# EAGLE design qtpy_midibff_disp (EAGLE 9.6.2)
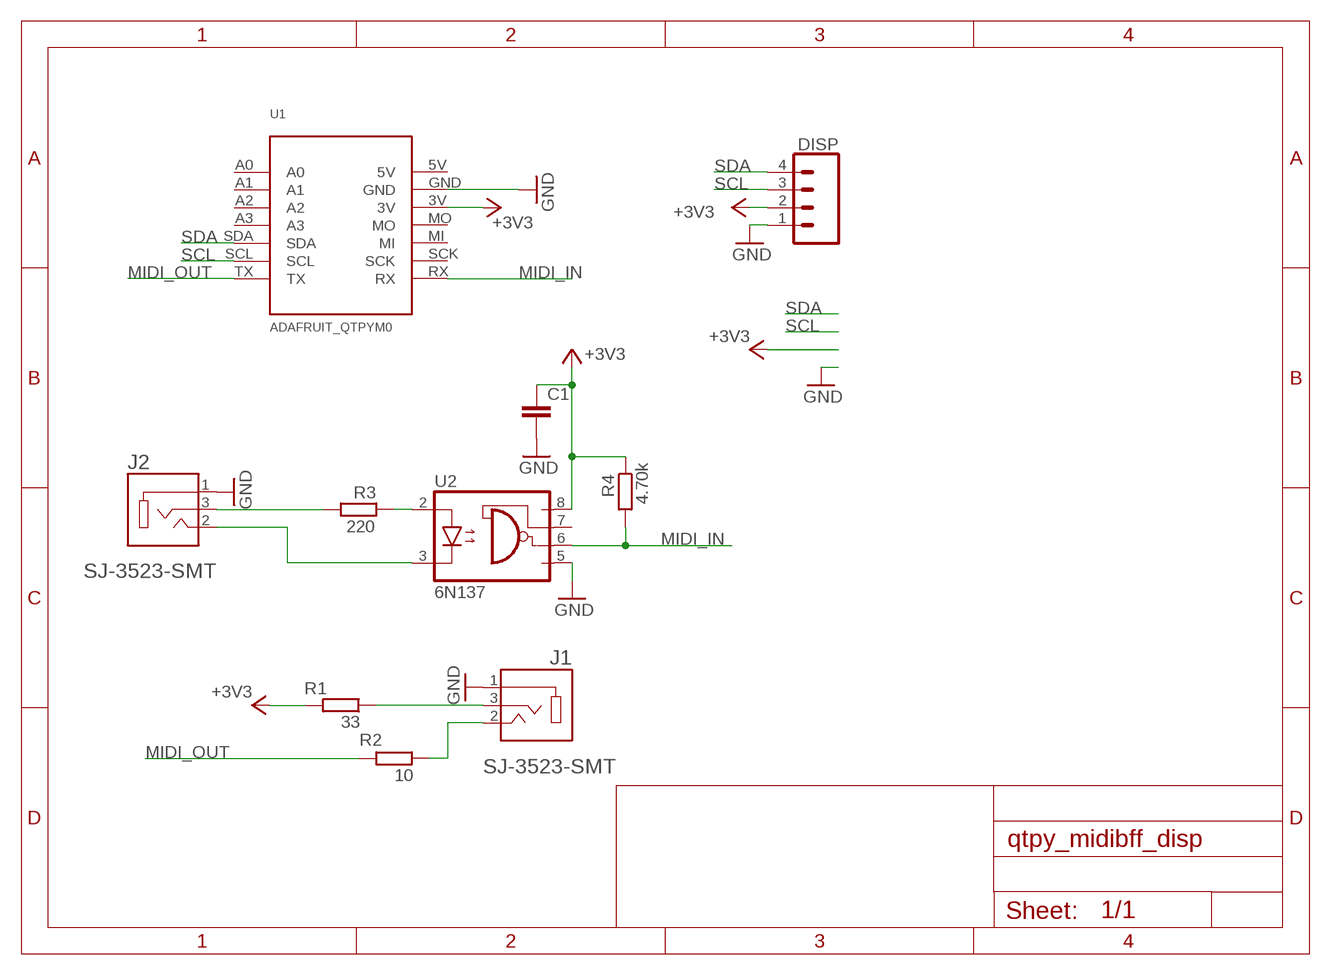
[diagram p0: schematic, sheet 1]

## Parts
C1  C-EU025-025X050  [C025-025X050]
DISP  CONN_04  [1X04]
J1  SJ-3523-SMT  [CUI_SJ-3523-SMT]
J2  SJ-3523-SMT  [CUI_SJ-3523-SMT]
R1  33  R-EU_0204/7  [0204/7]
R2  10  R-EU_0204/7  [0204/7]
R3  220  R-EU_0204/7  [0204/7]
R4  4.70k  R-EU_0204/7  [0204/7]
U1  ADAFRUIT_QTPYM0  [ADAFRUIT_QTPY_M0]
U2  6N137  [DIL08]

## Nets
+3V3: C1.1 DISP.2 R1.2 R4.1 U1.3V U2.8(VCC)
GND: C1.2 DISP.1 J1.1 J2.1 U1.GND U2.5(GND)
MIDI_IN: R4.2 U1.RX U2.6(VO)
MIDI_OUT: R2.2 U1.TX
N$1: J1.3 R1.1
N$2: R3.1 U2.2(A)
N$3: J2.2 U2.3(C)
N$4: J2.3 R3.2
N$5: J1.2 R2.1
SCL: DISP.3 U1.SCL
SDA: DISP.4 U1.SDA
Unconnected: U1.5V U1.A0 U1.A1 U1.A2 U1.A3 U1.MI U1.MO U1.SCK U2.7(VE)

## Library data of the parts
C1 = rcl:C-EU: CAPACITOR, European symbol; SPICEPREFIX: C
DISP = SparkFun-Connectors:CONN_04: Multi connection point. Often used as Generic Header-pin footprint for 0.1 inch spaced/style header connections On any of the 0.1 inch spaced packages, you can populate with these: Break Away Headers - Straight <https://www.sparkfun.com/products/116> (PRT-00116) Break Away Male Headers - Right Angle <https://www.sparkfun.com/products/553> (PRT-00553) Female Headers <https://www.sparkfun.com/products/115> (PRT-00115) Break Away Headers - Machine Pin <https://www.sparkfun.com/products/117> (PRT-00117) Break Away Female Headers - Swiss Machine Pin <https://www.sparkfun.com/products/743> (PRT-00743) For SCREWTERMINALS and SPRING TERMINALS visit here: Screw Terimnals on SparkFun.com <https://www.sparkfun.com/search/results?term=Screw+Terminals> (5mm/3.5mm/2.54mm spacing) This device is also useful as a general connection point to wire up your design to another part of your project. Our various solder wires solder well into these plated through hole pads. Hook-Up Wire - Assortment (Stranded, 22 AWG) <https://www.sparkfun.com/products/11375> (PRT-11375) Hook-Up Wire - Assortment (Solid Core, 22 AWG) <https://www.sparkfun.com/products/11367> (PRT-11367) View the entire wire category on our website here <https://www.sparkfun.com/categories/141> Special notes: Molex polarized connector foot print use with SKU : PRT-08231 with associated crimp pins and housings. 1MM SMD Version SKU: PRT-10208; PROD_ID: CONN-09696
J1 J2 = SJ-3523-SMT:SJ-3523-SMT: Audio Jack Connector 3.5 mm Low Profile Surface Mount Stereo Jack, 3 Pin Right-Angle; CUI_PURCHASE_URL: https://www.cuidevices.com/product/interconnect/connectors/audio-connectors/jacks/sj-352x-smt-series?utm_source=snapeda.com&utm_medium=referral&utm_campaign=snapedaBOM; DESCRIPTION: 3.5 mm, Stereo, Right Angle, Surface Mount (SMT), 3 Conductors, 0~1 Internal Switches, Audio Jack Connector; DIGI-KEY_PART_NUMBER: CP-3523SJCT-ND; MF: CUI Devices; MP: SJ-3523-SMT-TR; PACKAGE: None; PURCHASE-URL: https://pricing.snapeda.com/search/part/SJ-3523-SMT-TR/?ref=eda
R1-R4 = rcl:R-EU_: RESISTOR, European symbol; SPICEPREFIX: R
U1 = todstuff:ADAFRUIT_QTPY
U2 = optocoupler:6N137: MOTOROLA OPTO COUPLER; MPN: 6N137; OC_FARNELL: 1328376; OC_NEWARK: 52M1895

## Board
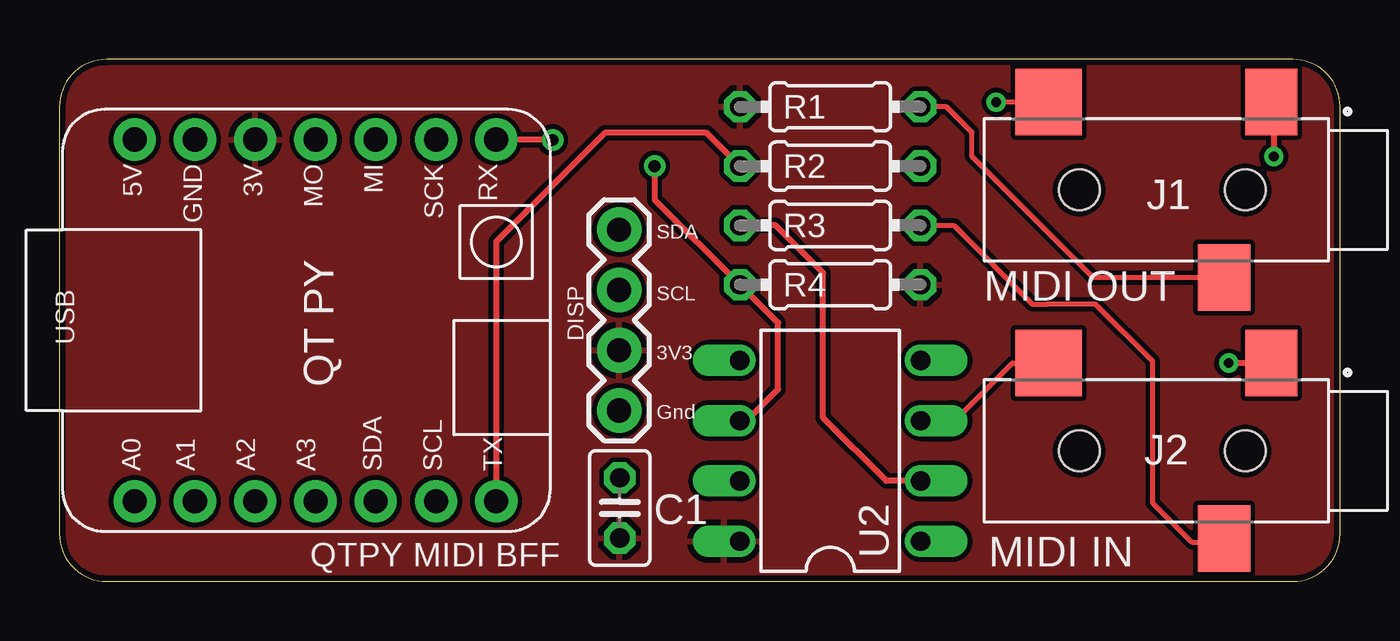
[diagram p1: board, top side]
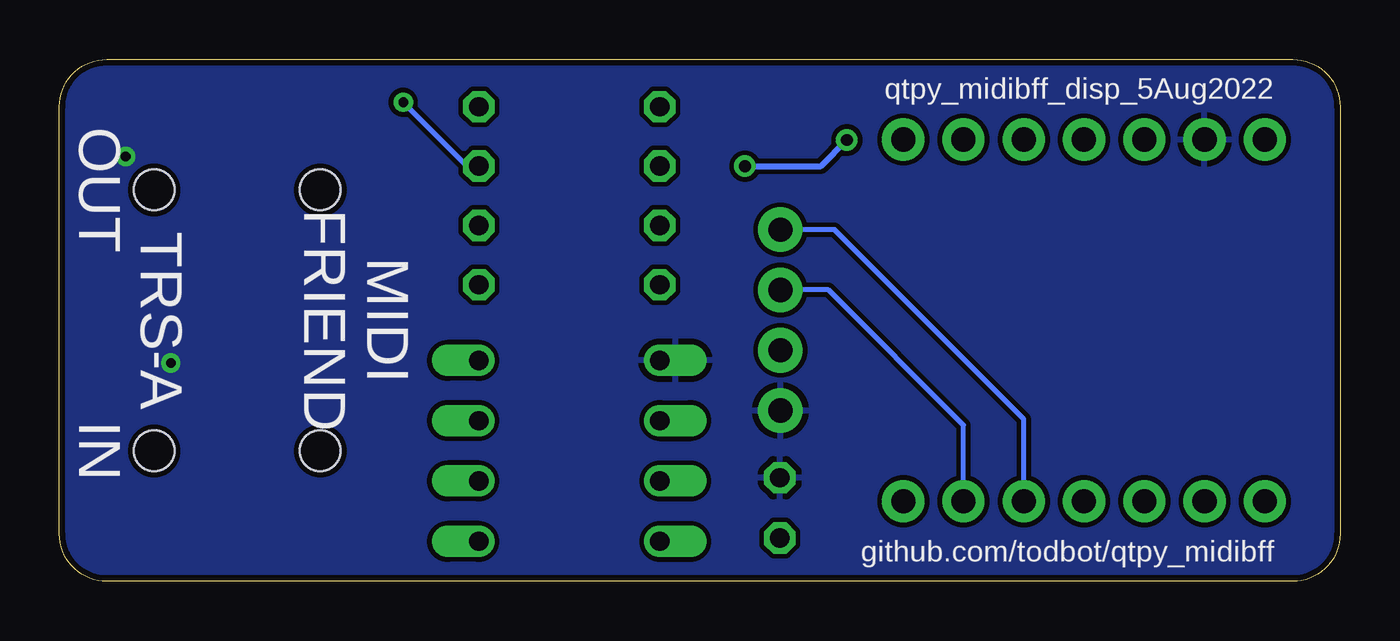
[diagram p2: board, bottom side, seen from below]

Size 54 x 22 mm. Coordinates in mm from the lower left corner, seen from the top.
Outline: 52,22 2,22 arc90 0,20 0,2 arc90 2,0 52,0 arc90 54,2 54,20 arc90 52,22
Copper layers (1*16): Top 0.035mm / dielectric 1.5mm / Bottom 0.035mm
Design rules "adafruit-rules-20180530": minimum track width 8mil, minimum drill 16mil, track to track 8mil, track to pad 8mil, pad to pad 8mil, via to via 8mil, smd to smd 8mil, copper to edge 10mil, drill to drill 8mil, minimum pad ring 10mil, minimum via ring 8mil, stop-mask expansion 4mil, vias tented up to drill 20mil, thermal gap 10mil

### Footprints (pad centres in the part's own frame; a part is rotated, then mirrored left to right if it is on the bottom)
C025-025X050 = drill 0.813 octagon: 1 -1.27,0; 2 1.27,0
1X04 = drill 1.016 pad 1.88: 1 0,0; 2 2.54,0; 3 5.08,0; 4 7.62,0
CUI_SJ-3523-SMT = smd 2.2 x 2.8: 1 -1.1,-3.7; 3 0.9,3.7 | smd 2.8 x 2.8: 2 8.3,-3.7 | hole 1.7: 0,0; 7,0
0204/7 = drill 0.813 octagon: 1 -3.81,0; 2 3.81,0
ADAFRUIT_QTPY_M0 = drill 1.016 pad 1.778: 3V 7.62,2.54; 5V 7.62,7.62; A0 -7.62,7.62; A1 -7.62,5.08; A2 -7.62,2.54; A3 -7.62,0; GND 7.62,5.08; MI 7.62,-2.54; MO 7.62,0; RX 7.62,-7.62; SCK 7.62,-5.08; SCL -7.62,-5.08; SDA -7.62,-2.54; TX -7.62,-7.62
DIL08 = drill 0.813 offset: 1 -3.81,-3.81; 2 -1.27,-3.81; 3 1.27,-3.81; 4 3.81,-3.81; 5 3.81,3.81; 6 1.27,3.81; 7 -1.27,3.81; 8 -3.81,3.81

### Placement (x,y rotation side)
C1  23.62,3.1 90 top
DISP  23.6,7.2 90 top
J1  50,16.5 180 top
J2  50,5.5 180 top
R1  32.5,20 180 top
R2  32.5,17.5 180 top
R3  32.5,15 0 top
R4  32.5,12.5 180 top
U1  10.8,11 90 top
U2  32.5,5.5 90 top

### Tracks (layer width: path | path; a pad name or v marks a point on that pad's centre or on a via)
+3V3
  pour Top: 55.1,23.17 55.1,-1.02 -1.4,-1.02 -1.4,23.17
GND  (via drill 0.41)
  Top 0.254: J1.1 51.2,20.1 v51.2,17.9 | J2.1 v49.3,9.2
  pour Bottom: -1.27,22.67 55.13,22.67 55.13,-1.02 -1.27,-1.02
MIDI_IN  (via drill 0.5)
  Top 0.254: U2.6 28.97,6.77 30.3,8.1 30.3,10.9 R4.2 25.1,16.09 v25.1,17.5 | v20.8,18.6 18.44,18.6 U1.RX
  Bottom 0.254: v20.8,18.6 21.9,17.5 v25.1,17.5
MIDI_OUT
  Top 0.254: U1.TX 18.42,13.9 18.42,14.32 18.62,14.52 21.55,17.45 23,18.9 27.29,18.9 R2.2
N$1
  Top 0.203: J1.3 43.59,12.8 38.48,17.91 38.48,18.92 37.4,20 R1.1
N$2
  Top 0.254: U2.2 34.87,4.23 32.2,6.9 32.2,13 30.2,15 R3.1
N$3
  Top 0.203: U2.3 37.76,6.77 40.19,9.2 J2.2
N$4
  Top 0.203: J2.3 48.95,1.65 47.75,1.65 46.1,3.3 46.1,9.27 43.69,11.68 41.66,11.68 41.02,11.68 37.7,15 R3.2
N$5  (via drill 0.41)
  Top 0.203: J1.2 v39.5,20.19
  Bottom 0.203: v39.5,20.19 36.8,17.5 R2.1
SCL
  Bottom 0.203: U1.SCL 15.88,6.58 21.58,12.28 DISP.3
SDA
  Bottom 0.203: U1.SDA 13.34,6.84 21.32,14.82 DISP.4

### Text on the board
tPlace: SDA | SCL | MIDI OUT | 3V3 | Gnd | QTPY MIDI BFF | MIDI IN
bPlace: qtpy_midibff_disp_5Aug2022 | OUT | MIDI / FRIEND | TRS-A | IN | github.com/todbot/qtpy_midibff